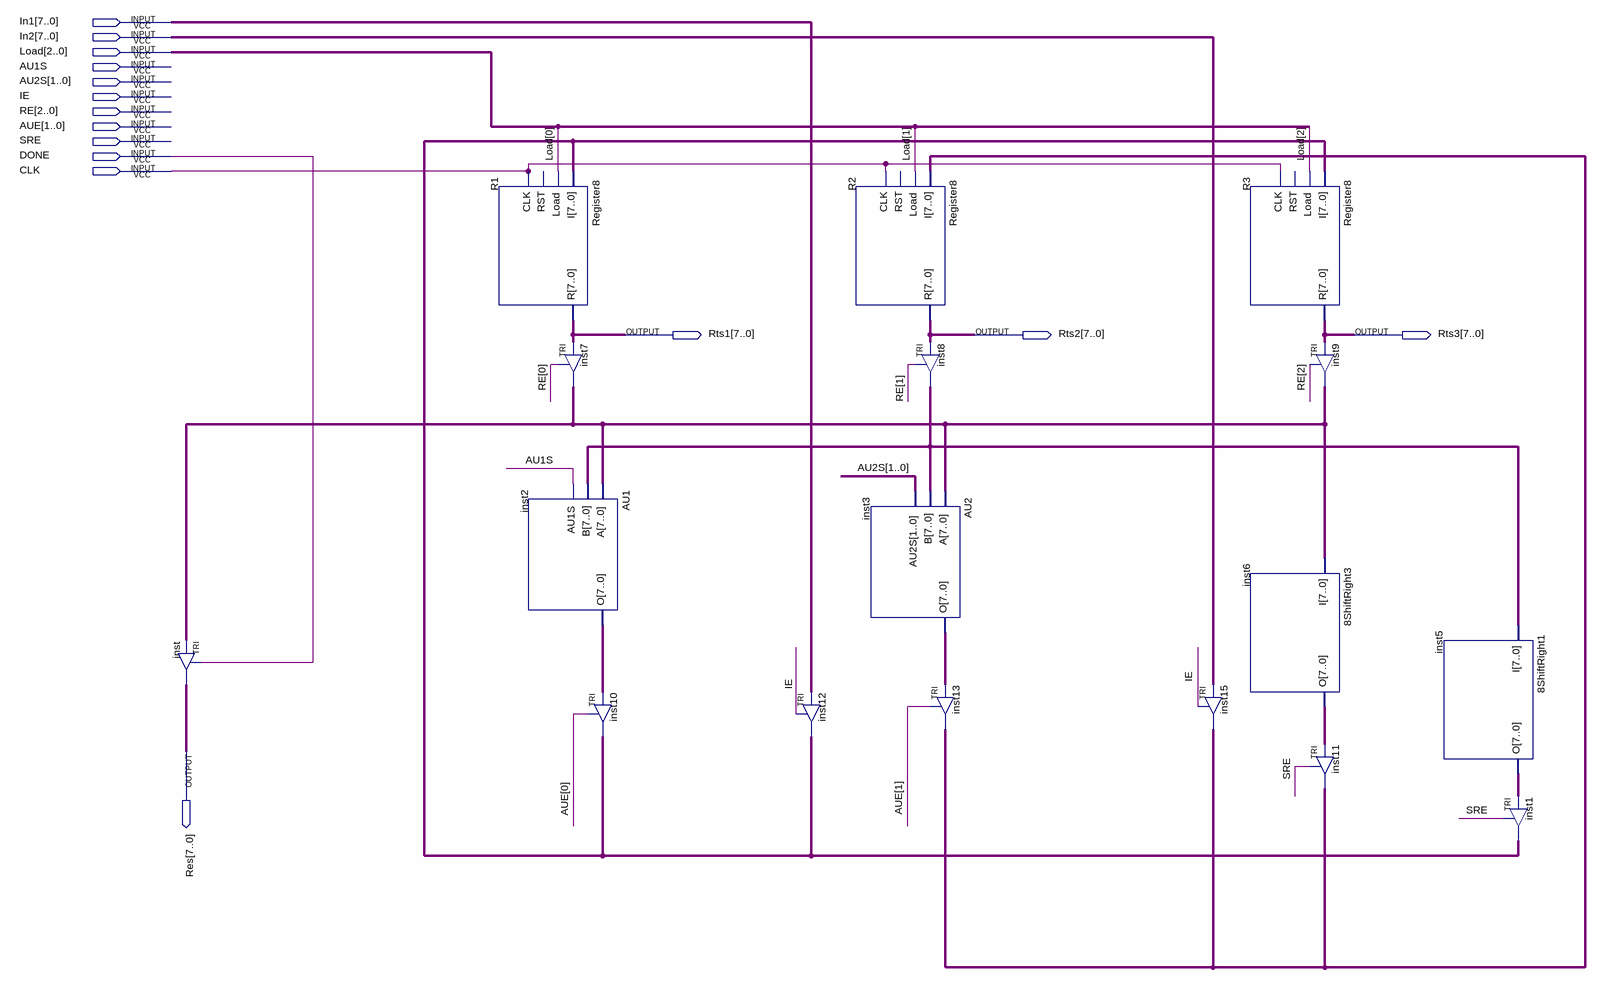
[diagram p0: schematic sheet]
// Quartus schematic DtpBS.bdf as structural Verilog: 17 symbols, 15 pins
module DtpBS (
  input  [7:0] In1,
  input  [7:0] In2,
  input  [2:0] Load,
  input  AU1S,
  input  [1:0] AU2S,
  input  IE,
  input  [2:0] RE,
  input  [1:0] AUE,
  input  SRE,
  input  DONE,
  input  CLK,
  output [7:0] Rts1,
  output [7:0] Rts2,
  output [7:0] Rts3,
  output [7:0] Res
);

  wire [7:0] inst2_o, inst3_o, inst5_o, inst6_o, inst7_out, inst8_out, inst10_out, inst13_out;

  TRI inst[7:0] (.IN(inst7_out), .OE(DONE), .OUT(Res));
  Register8 R1 (.I(inst10_out), .Load(Load[0]), .CLK(CLK), .R(Rts1));  // open: RST
  AU1 inst2 (.B(inst8_out), .A(inst7_out), .AU1S(AU1S), .O(inst2_o));
  TRI inst7[7:0] (.IN(Rts1), .OE(RE[0]), .OUT(inst7_out));
  TRI inst10[7:0] (.IN(inst2_o), .OE(AUE[0]), .OUT(inst10_out));
  TRI inst12[7:0] (.IN(In1), .OE(IE), .OUT(inst10_out));
  Register8 R2 (.I(inst13_out), .Load(Load[1]), .CLK(CLK), .R(Rts2));  // open: RST
  AU2 inst3 (.A(inst7_out), .B(inst8_out), .AU2S(AU2S), .O(inst3_o));
  TRI inst8[7:0] (.IN(Rts2), .OE(RE[1]), .OUT(inst8_out));
  TRI inst13[7:0] (.IN(inst3_o), .OE(AUE[1]), .OUT(inst13_out));
  TRI inst15[7:0] (.IN(In2), .OE(IE), .OUT(inst13_out));
  Register8 R3 (.I(inst10_out), .Load(Load[2]), .CLK(CLK), .R(Rts3));  // open: RST
  \8ShiftRight3  inst6 (.I(inst7_out), .O(inst6_o));
  TRI inst9[7:0] (.IN(Rts3), .OE(RE[2]), .OUT(inst7_out));
  TRI inst11[7:0] (.IN(inst6_o), .OE(SRE), .OUT(inst13_out));
  \8ShiftRight1  inst5 (.I(inst8_out), .O(inst5_o));
  TRI inst1[7:0] (.IN(inst5_o), .OE(SRE), .OUT(inst10_out));
endmodule
